# Altium schematic sheet DP10.SchDoc
size A4; SheetNumber: 5; SheetTotal: 6
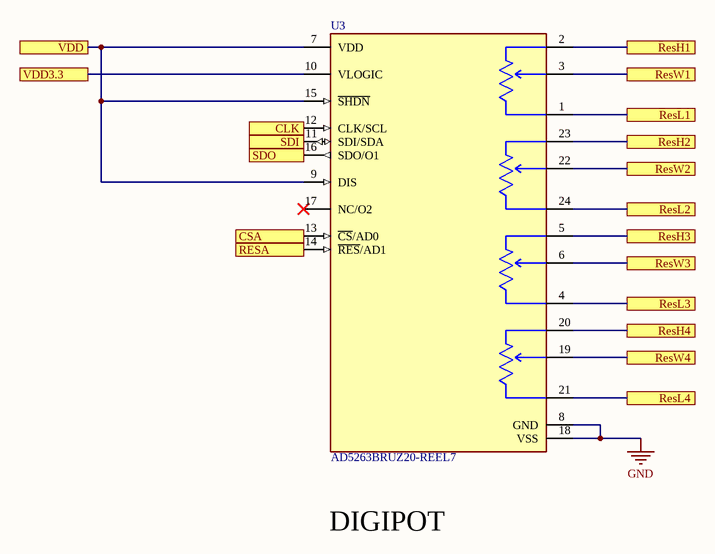
[diagram p0: DP10.SchDoc]

## Parts
U3  AD5263BRUZ20-REEL7  [FP-RU-24-IPC_A]

## Ports
CLK (see THE_FIRST[8D], DP[2B]), CSA (see THE_FIRST[8D], DP[2B]), RESA (see THE_FIRST[8D], DP[2B]), ResH1 (see THE_FIRST[9E]), ResH2 (see THE_FIRST[9D]), ResH3 (see THE_FIRST[9D]), ResH4 (see THE_FIRST[9D]), ResL1 (see THE_FIRST[9D]), ResL2 (see THE_FIRST[9D]), ResL3 (see THE_FIRST[9D]), ResL4 (see THE_FIRST[9D]), ResW1 (see THE_FIRST[9D]), ResW2 (see THE_FIRST[9D]), ResW3 (see THE_FIRST[9D]), ResW4 (see THE_FIRST[9D]), SDI (see THE_FIRST[8D]), SDO (see THE_FIRST[8D]), VDD3.3 (see THE_FIRST[8E], DP[2B]), VDD (see THE_FIRST[9E], DP[2B], LDO3.3[1B], ldo[1B], lm334sm[2B])

## Nets
GND: U3.8(GND) U3.18(VSS)
CLK: U3.12(CLK/SCL) ; port CLK
CSA: U3.13(~{CS}/AD0) ; port CSA
RESA: U3.14(~{RES}/AD1) ; port RESA
ResH1: U3.2(A1) ; port ResH1
ResH2: U3.23(A2) ; port ResH2
ResH3: U3.5(A3) ; port ResH3
ResH4: U3.20(A4) ; port ResH4
ResL1: U3.1(B1) ; port ResL1
ResL2: U3.24(B2) ; port ResL2
ResL3: U3.4(B3) ; port ResL3
ResL4: U3.21(B4) ; port ResL4
ResW1: U3.3(W1) ; port ResW1
ResW2: U3.22(W2) ; port ResW2
ResW3: U3.6(W3) ; port ResW3
ResW4: U3.19(W4) ; port ResW4
SDI: U3.11(SDI/SDA) ; port SDI
SDO: U3.16(SDO/O1) ; port SDO
VDD: U3.7(VDD) U3.9(DIS) U3.15(~{SHDN}) ; port VDD
VDD3.3: U3.10(VLOGIC) ; port VDD3.3

Not connected (* = marked no-connect by the designer): U3 17(NC/O2)*

## Notes on the sheet
- DIGIPOT

## Library data of the parts
U3 = CMP-09083-000144-1: IC DGT POT 50KOHM 256TAP 24TSSOP; Operating Supply Voltage: 5V; Memory Type: Volatile; Max Supply Current: 1uA; Frequency: 25MHz; Number of Circuits: 4; Min Supply Voltage: 2.7V; Number of Positions: 256; Temperature Coefficient: 650ppm/°C; Max Dual Supply Voltage: 7.5V; Max Supply Voltage: 16.5V; Min Dual Supply Voltage: 4.5V; Resistance: 50kR; -3db Bandwidth: 300kHz; Interface: I2C; Tolerance: 30%; Lead Free: Contains Lead; Series: -; Dual Supply Voltage: 5V; Operating Supply Current: 1uA; Package Quantity: 1000; RoHS Compliant: Yes; Supply Current: 1uA; Case/Package: TSSOP; Contact Plating: Tin; Nominal Supply Current: 1uA; Mount: Surface Mount; Min Operating Temperature: -40°C; Number of Pins: 24; Taper: Linear; Max Operating Temperature: 125°C; Packaging: Tape and Reel; Number of Elements: 4; Number of Taps: 256